# EAGLE design Esquema (EAGLE 9.6.2)
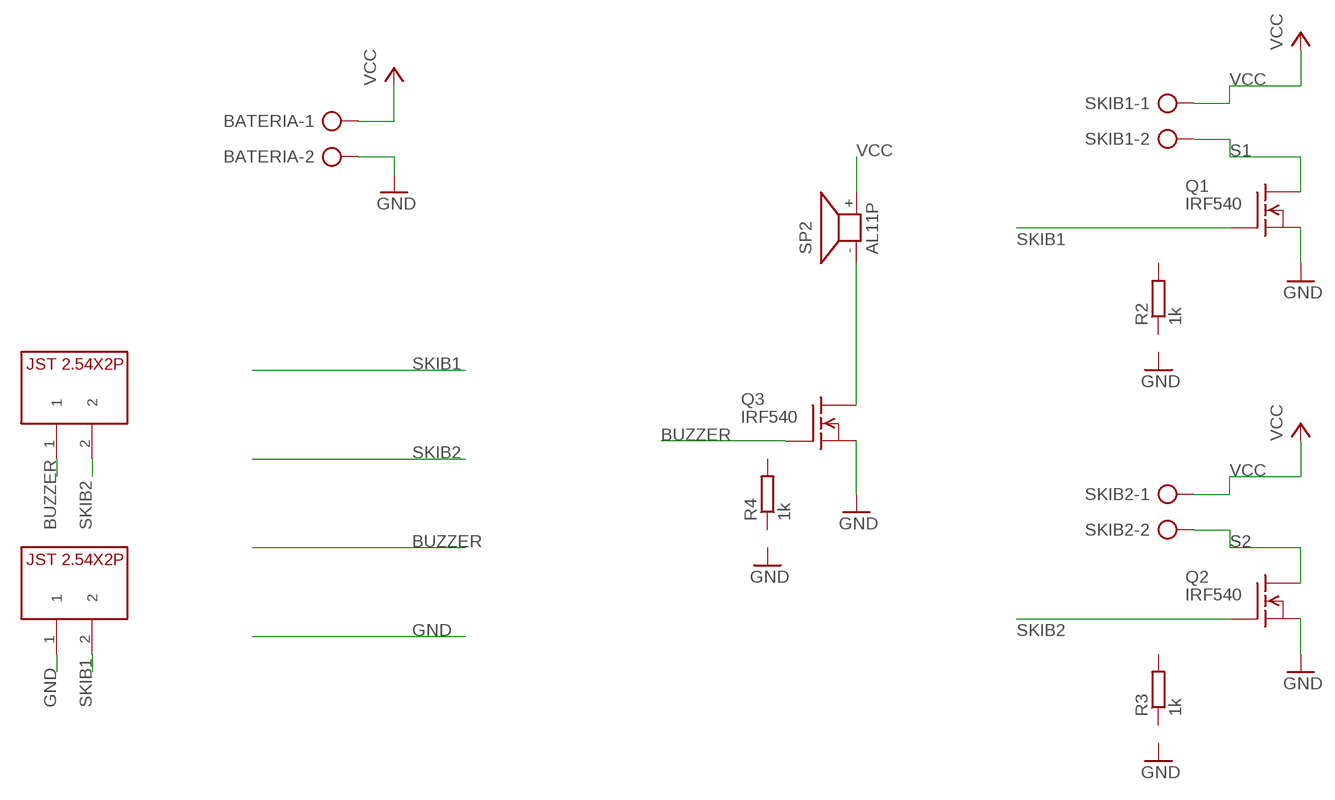
[diagram p0: schematic, sheet 1]

## Parts
BATERIA  AK500/2-H  [AK500/2-H]
Q1  IRF540  [TO220]
Q2  IRF540  [TO220]
Q3  IRF540  [TO220]
R2  1k  R-EU_0207/10  [0207/10]
R3  1k  R-EU_0207/10  [0207/10]
R4  1k  R-EU_0207/10  [0207/10]
SKIB1  AK500/2-H  [AK500/2-H]
SKIB2  AK500/2-H  [AK500/2-H]
SP2  AL11P  [AL11P]
U$1  JST2.54X2P  [JST2.54X2P_FOOTPRINT]
U$2  JST2.54X2P  [JST2.54X2P_FOOTPRINT]

## Nets
BUZZER: Q3.1(G) U$1.1
GND: BATERIA.2 Q1.3(S) Q2.3(S) Q3.3(S) U$2.1
N$2: Q3.2(D) SP2.-
S1: Q1.2(D) SKIB1.2
S2: Q2.2(D) SKIB2.2
SKIB1: Q1.1(G) U$2.2
SKIB2: Q2.1(G) U$1.2
VCC: BATERIA.1 SKIB1.1 SKIB2.1 SP2.+
Unconnected: R2.1 R2.2 R3.1 R3.2 R4.1 R4.2

## Library data of the parts
BATERIA SKIB1 SKIB2 = con-ptr500:AK500/2-H: CONNECTOR Aug. 2004 / PTR Meßtechnik: Die Bezeichnung der Serie AK505 wurde geändert. Es handelt sich hierbei um AK500 in horizontaler Ausführung.; OC_FARNELL: unknown; OC_NEWARK: unknown
Q1-Q3 = transistor-fet:IRF540: N-Channel Enhancement MOSFET (HEXFET); 100V; 28A; 0,077Ohm
R2-R4 = rcl:R-EU_: RESISTOR, European symbol; SPICEPREFIX: R
SP2 = buzzer:AL11P: SPEAKER Source: Buerklin; OC_FARNELL: unknown; OC_NEWARK: unknown
U$1 U$2 = CRD:JST2.54X2P: Conector JST 2 pinos (2.54mm de distância entre pinos)

## Board
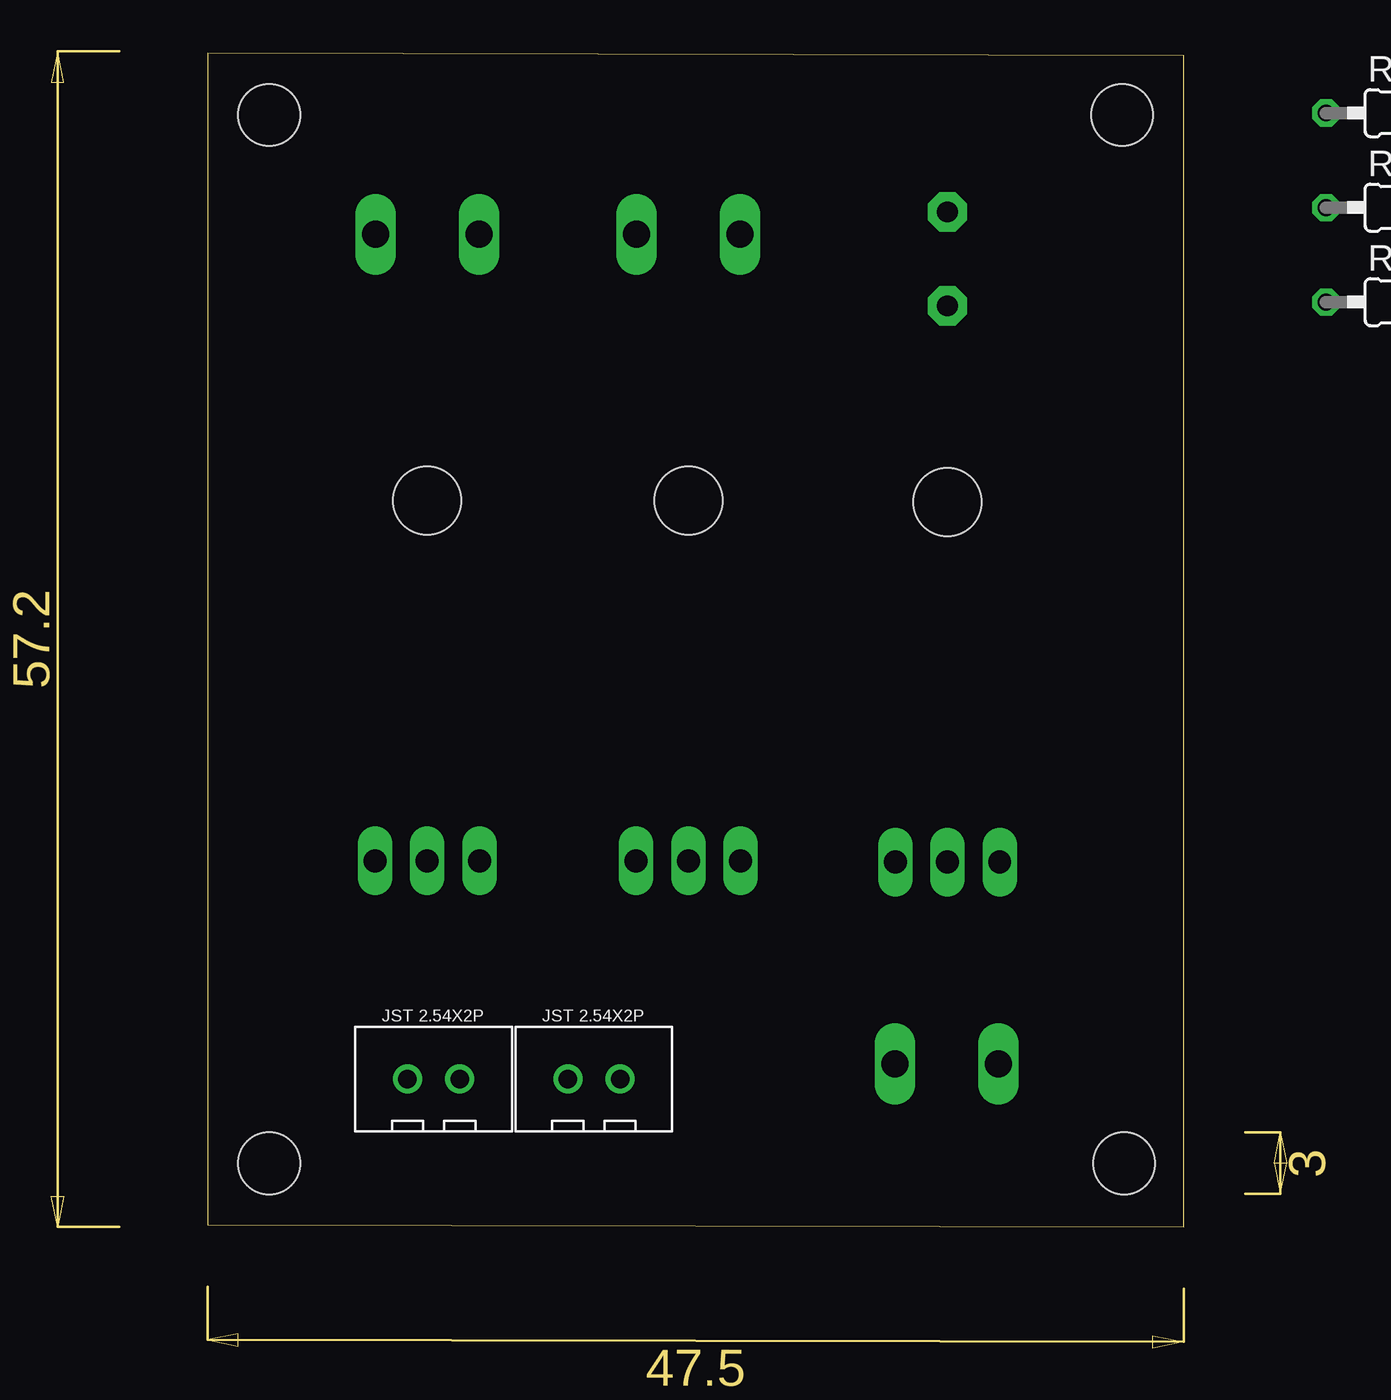
[diagram p1: board, top side]
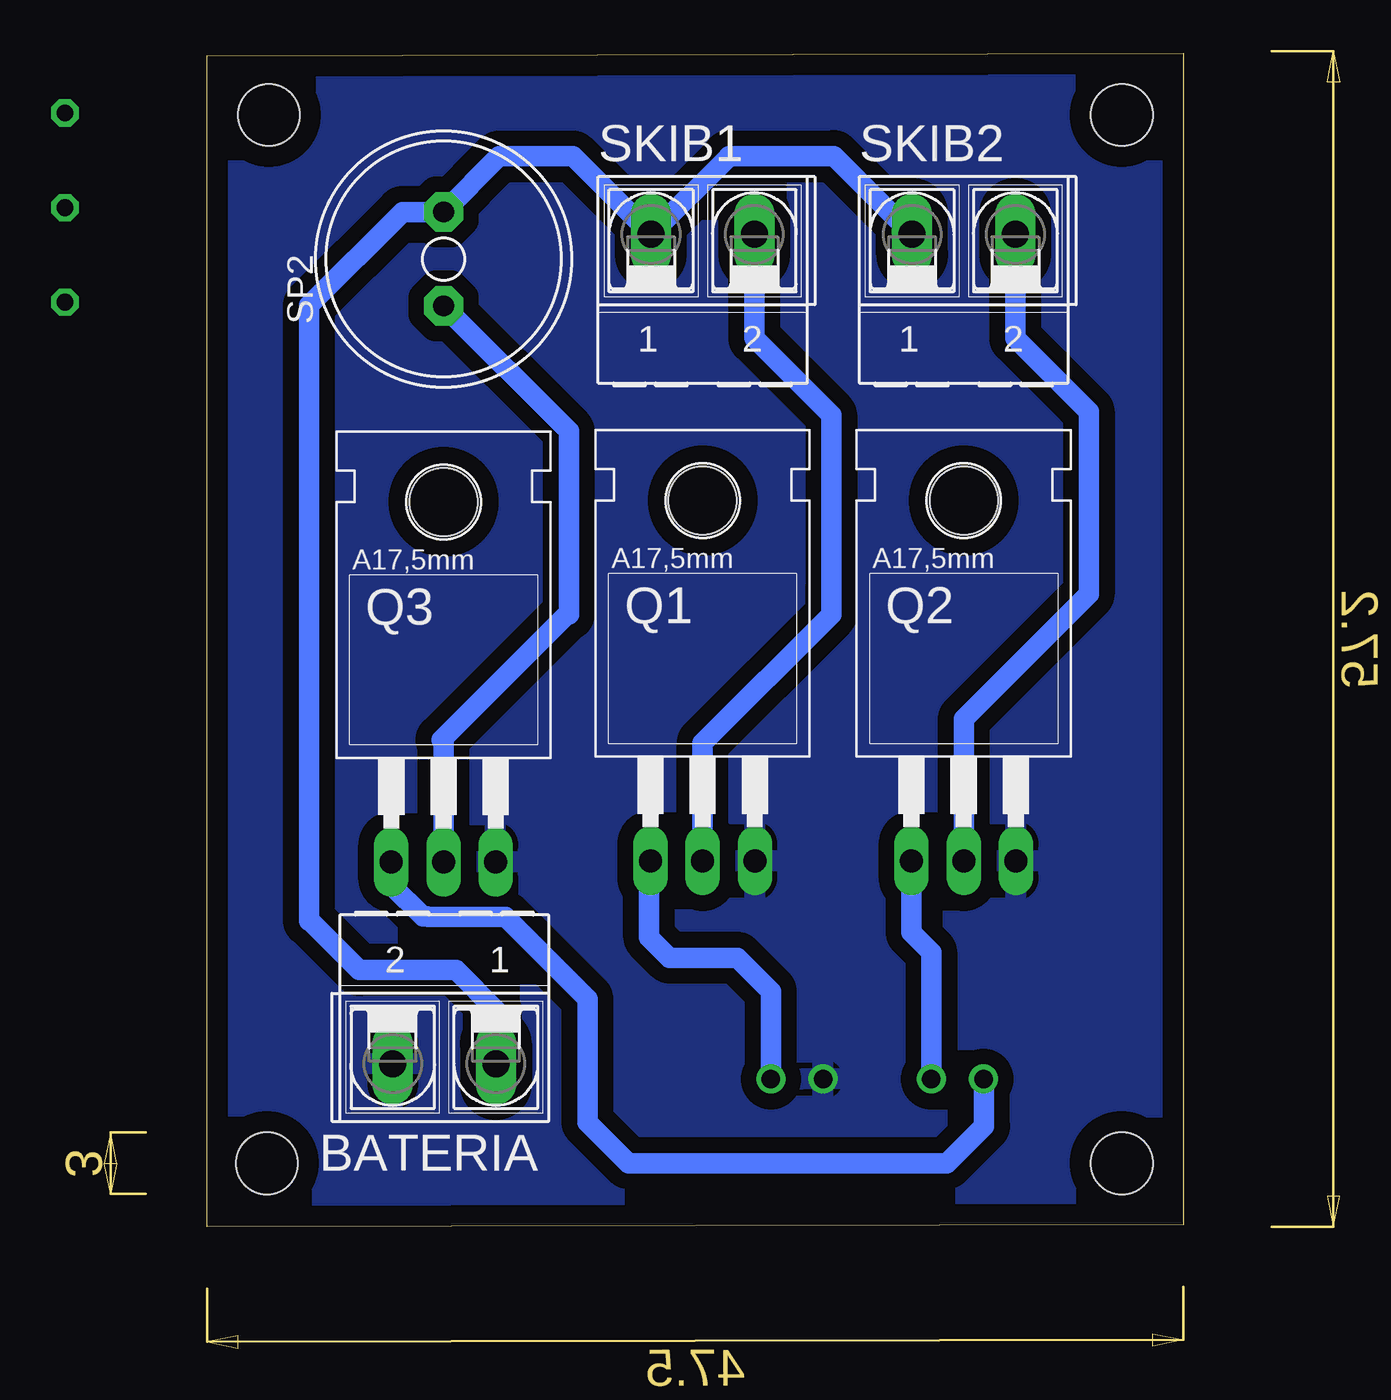
[diagram p2: board, bottom side, seen from below]

Size 47.5 x 57.1 mm. Coordinates in mm from the lower left corner, seen from the top.
Outline: 0,0.1 47.5,0 47.5,57 0,57.1 0,0.1
Copper layers (1*16): Top 0.035mm / dielectric 1.5mm / Bottom 0.035mm
Design rules "default *": minimum track width 1mm, minimum drill 0.35mm, track to track 30mil, track to pad 0.5mm, pad to pad 6mil, via to via 6mil, smd to smd 6mil, copper to edge 40mil, drill to drill 6mil, minimum pad ring 10mil, minimum via ring 8mil, stop-mask expansion 4mil, vias tented up to drill 0mil, thermal gap 10mil
Holes 3 mm at 44.5,54.1 3,54.1 44.6,3.1 3,3.1

### Footprints (pad centres in the part's own frame; a part is rotated, then mirrored left to right if it is on the bottom)
AK500/2-H = drill 1.321 long: 1 -2.515,0; 2 2.515,0
TO220 = drill 1.118 long: 1 -2.54,-6.35; 2 0,-6.35; 3 2.54,-6.35 | hole 3.302: 0,11.176
0207/10 = drill 0.813 octagon: 1 -5.08,0; 2 5.08,0
AL11P = drill 1.016 pad 1.905 octagon: + 2.286,0; - -2.286,0
JST2.54X2P_FOOTPRINT = drill 0.9: 1 -1.27,0; 2 1.27,0

### Placement (x,y rotation side)
BATERIA  35.96,7.94 180 bottom
Q1  23.39,24.17 0 bottom
Q2  10.69,24.17 0 bottom
Q3  36,24.1 0 bottom
R2  59.5,54.2 0 top  (outside the outline)
R3  59.5,49.6 0 top  (outside the outline)
R4  59.5,45 0 top  (outside the outline)
SKIB1  23.39,48.3 0 bottom
SKIB2  10.69,48.3 0 bottom
SP2  36,47.1 90 bottom
U$1  11,7.2 0 top
U$2  18.8,7.2 0 top

### Tracks (layer width: path | path; a pad name or v marks a point on that pad's centre or on a via)
BUZZER
  Bottom 1: Q3.1 38.54,16.64 37,15.1 36.79,15.1 36.76,15.07 32.97,15.07 29,11.1 29,5.1 27,3.1 11.5,3.1 9.7,4.9 9.7,7.17 U$1.1
GND
  pour Bottom: 1,56.1 1,1.1 46.6,1.1 46.6,56.1
N$2
  Bottom 1: SP2.- 29.9,38.71 29.9,29.8 30,29.8 36.1,23.7 36,23.6 Q3.2
S1
  Bottom 1: Q1.2 23.39,23.55 17.13,29.81 17.13,31.1 17.13,39.5 17.86,40.23 20.88,43.25 SKIB1.2
S2
  Bottom 1: Q2.2 10.69,24.71 4.61,30.79 4.61,39.68 5.01,40.09 8.18,43.25 SKIB2.2
SKIB1
  Bottom 1: Q1.1 26,17.75 26,14.1 25,13.1 21.7,13.1 20.07,11.47 U$2.2
SKIB2
  Bottom 1: Q2.1 13.23,14.33 12.27,13.37 U$1.2
VCC
  Bottom 1: SKIB2.1 17.02,52.11 22.12,52.11 22.12,52.09 SKIB1.1 29.7,52.1 33.29,52.1 SP2.+ 38,49.39 42.54,44.84 42.54,14.9 42.5,14.9 40.1,12.5 35.4,12.5 33.45,10.54 BATERIA.1